# Altium schematic sheet console_schematic_logic.SchDoc
size A4
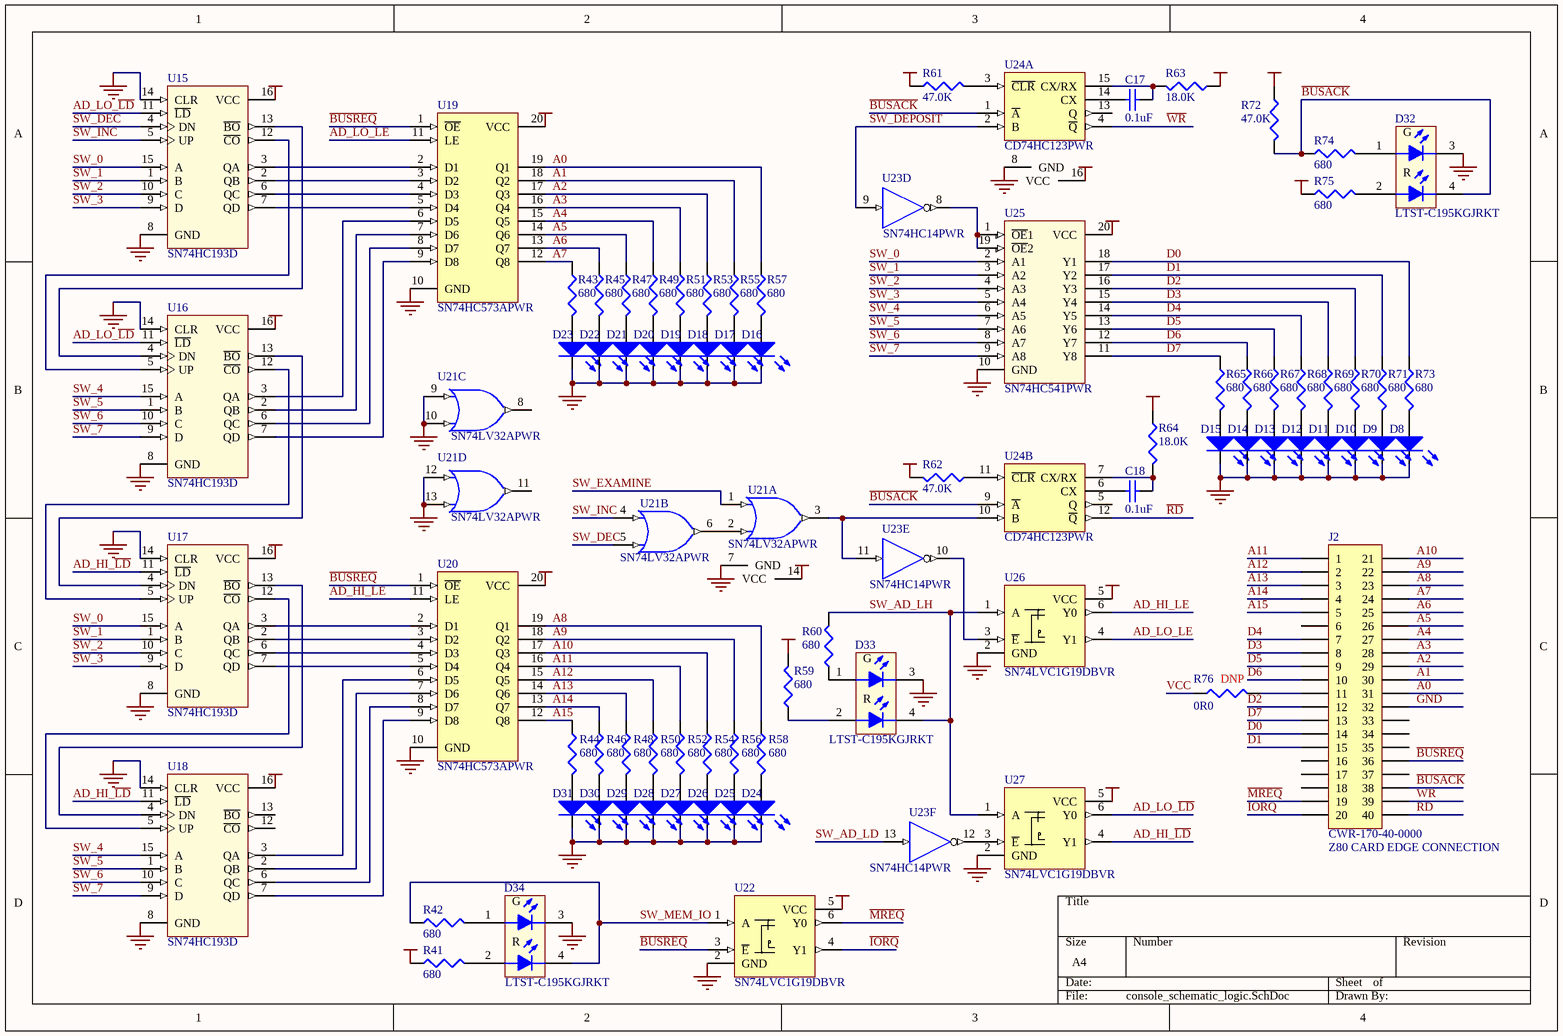
[diagram p0: console_schematic_logic.SchDoc]

## Parts
C17  0.1uF  [0603]
C18  0.1uF  [0603]
D8  LTST-C190KRKT  [APG1608]  (value not drawn)
D9  LTST-C190KRKT  [APG1608]  (value not drawn)
D10  LTST-C190KRKT  [APG1608]  (value not drawn)
D11  LTST-C190KRKT  [APG1608]  (value not drawn)
D12  LTST-C190KRKT  [APG1608]  (value not drawn)
D13  LTST-C190KRKT  [APG1608]  (value not drawn)
D14  LTST-C190KRKT  [APG1608]  (value not drawn)
D15  LTST-C190KRKT  [APG1608]  (value not drawn)
D16  LTST-C190KRKT  [APG1608]  (value not drawn)
D17  LTST-C190KRKT  [APG1608]  (value not drawn)
D18  LTST-C190KRKT  [APG1608]  (value not drawn)
D19  LTST-C190KRKT  [APG1608]  (value not drawn)
D20  LTST-C190KRKT  [APG1608]  (value not drawn)
D21  LTST-C190KRKT  [APG1608]  (value not drawn)
D22  LTST-C190KRKT  [APG1608]  (value not drawn)
D23  LTST-C190KRKT  [APG1608]  (value not drawn)
D24  LTST-C190KRKT  [APG1608]  (value not drawn)
D25  LTST-C190KRKT  [APG1608]  (value not drawn)
D26  LTST-C190KRKT  [APG1608]  (value not drawn)
D27  LTST-C190KRKT  [APG1608]  (value not drawn)
D28  LTST-C190KRKT  [APG1608]  (value not drawn)
D29  LTST-C190KRKT  [APG1608]  (value not drawn)
D30  LTST-C190KRKT  [APG1608]  (value not drawn)
D31  LTST-C190KRKT  [APG1608]  (value not drawn)
D32  LTST-C195KGJRKT  [LTST-C195KGJRKT]
D33  LTST-C195KGJRKT  [LTST-C195KGJRKT]
D34  LTST-C195KGJRKT  [LTST-C195KGJRKT]
J2  CWR-170-40-0000  Notes: Z80 CARD EDGE CONNECTION  [CARD EDGE 40 PIN]
R41  680  [0603]
R42  680  [0603]
R43  680  [0603]
R44  680  [0603]
R45  680  [0603]
R46  680  [0603]
R47  680  [0603]
R48  680  [0603]
R49  680  [0603]
R50  680  [0603]
R51  680  [0603]
R52  680  [0603]
R53  680  [0603]
R54  680  [0603]
R55  680  [0603]
R56  680  [0603]
R57  680  [0603]
R58  680  [0603]
R59  680  [0603]
R60  680  [0603]
R61  47.0K  [0603]
R62  47.0K  [0603]
R63  18.0K  [0603]
R64  18.0K  [0603]
R65  680  [0603]
R66  680  [0603]
R67  680  [0603]
R68  680  [0603]
R69  680  [0603]
R70  680  [0603]
R71  680  [0603]
R72  47.0K  [0603]
R73  680  [0603]
R74  680  [0603]
R75  680  [0603]
R76  0R0  Load: DNP  [0603]
U15  SN74HC193D  [DO16 D R-PDSO-G16]
U16  SN74HC193D  [DO16 D R-PDSO-G16]
U17  SN74HC193D  [DO16 D R-PDSO-G16]
U18  SN74HC193D  [DO16 D R-PDSO-G16]
U19  SN74HC573APWR  [PW020]
U20  SN74HC573APWR  [PW020]
U21  SN74LV32APWR  [PW014]  (parts A,B,C,D of 4)
U22  SN74LVC1G19DBVR  [SOT-23-6 DBV R-PDSO-G6]
U23  SN74HC14PWR  [PW014]  (parts D,E,F of 6)
U24  CD74HC123PWR  [PW016]  (parts A,B of 2)
U25  SN74HC541PWR  [PW020]
U26  SN74LVC1G19DBVR  [SOT-23-6 DBV R-PDSO-G6]
U27  SN74LVC1G19DBVR  [SOT-23-6 DBV R-PDSO-G6]

## Nets
GND: D8.2(K) D9.2(K) D10.2(K) D11.2(K) D12.2(K) D13.2(K) D14.2(K) D15.2(K) D16.2(K) D17.2(K) D18.2(K) D19.2(K) D20.2(K) D21.2(K) D22.2(K) D23.2(K) D24.2(K) D25.2(K) D26.2(K) D27.2(K) D28.2(K) D29.2(K) D30.2(K) D31.2(K) D32.3(K1) D33.3(K1) D34.3(K1) J2.32 U15.8(GND) U15.14(CLR) U16.8(GND) U16.14(CLR) U17.8(GND) U17.14(CLR) U18.8(GND) U18.14(CLR) U19.10(GND) U20.10(GND) U21.7(GND) U21.9(A) U21.10(B) U21.12(A) U21.13(B) U22.2(GND) U23.7(GND) U24.8(GND) U25.10(GND) U26.2(GND) U27.2(GND)
VCC: R41.1 R59.2 R61.1 R62.2 R63.1 R64.1 R72.1 R75.1 R76.1 U15.16(VCC) U16.16(VCC) U17.16(VCC) U18.16(VCC) U19.20(VCC) U20.20(VCC) U21.14(VCC) U22.5(VCC) U23.14(VCC) U24.16(VCC) U25.20(VCC) U26.5(VCC) U27.5(VCC)
A0: J2.31 R57.1 U19.19(Q1)
A1: J2.30 R55.1 U19.18(Q2)
A2: J2.29 R53.1 U19.17(Q3)
A3: J2.28 R51.1 U19.16(Q4)
A4: J2.27 R49.1 U19.15(Q5)
A5: J2.26 R47.1 U19.14(Q6)
A6: J2.25 R45.1 U19.13(Q7)
A7: J2.24 R43.1 U19.12(Q8)
A8: J2.23 R58.1 U20.19(Q1)
A9: J2.22 R56.1 U20.18(Q2)
A10: J2.21 R54.1 U20.17(Q3)
A11: J2.1 R52.1 U20.16(Q4)
A12: J2.2 R50.1 U20.15(Q5)
A13: J2.3 R48.1 U20.14(Q6)
A14: J2.4 R46.1 U20.13(Q7)
A15: J2.5 R44.1 U20.12(Q8)
AD_HI_~{LD}: U17.11(~{LD}) U18.11(~{LD}) U27.4(Y1)
AD_HI_LE: U20.11(LE) U26.6(Y0)
AD_LO_~{LD}: U15.11(~{LD}) U16.11(~{LD}) U27.6(Y0)
AD_LO_LE: U19.11(LE) U26.4(Y1)
~{BUSACK}: D32.4(K2) J2.38 R72.2 R74.1 U24.1(~{A}) U24.9(~{A})
~{BUSREQ}: J2.36 U19.1(~{OE}) U20.1(~{OE}) U22.3(~{E})
D0: J2.14 R73.1 U25.18(Y1)
D1: J2.15 R71.1 U25.17(Y2)
D2: J2.12 R70.1 U25.16(Y3)
D3: J2.8 R69.1 U25.15(Y4)
D4: J2.7 R68.1 U25.14(Y5)
D5: J2.9 R67.1 U25.13(Y6)
D6: J2.10 R66.1 U25.12(Y7)
D7: J2.13 R65.1 U25.11(Y8)
~{IORQ}: J2.20 U22.4(Y1)
~{MREQ}: J2.19 U22.6(Y0)
~{RD}: J2.40 U24.12(~{Q})
SW_0: U15.15(A) U17.15(A) U25.2(A1)
SW_1: U15.1(B) U17.1(B) U25.3(A2)
SW_2: U15.10(C) U17.10(C) U25.4(A3)
SW_3: U15.9(D) U17.9(D) U25.5(A4)
SW_4: U16.15(A) U18.15(A) U25.6(A5)
SW_5: U16.1(B) U18.1(B) U25.7(A6)
SW_6: U16.10(C) U18.10(C) U25.8(A7)
SW_7: U16.9(D) U18.9(D) U25.9(A8)
SW_AD_LD: U23.13(A)
SW_AD_LH: D33.4(K2) R60.2 U26.1(A) U27.1(A)
SW_DEC: U15.4(DN) U21.5(B)
SW_DEPOSIT: U23.9(A) U24.2(B)
SW_EXAMINE: U21.1(A)
SW_INC: U15.5(UP) U21.4(A)
SW_MEM_IO: D34.4(K2) R42.1 U22.1(A)
~{WR}: J2.39 U24.4(~{Q})
NetC17_1: C17.1 U24.14(CX)
NetC17_2: C17.2 R63.2 U24.15(CX/RX)
NetC18_1: C18.1 U24.6(CX)
NetC18_2: C18.2 R64.2 U24.7(CX/RX)
NetD8_1: D8.1(A) R73.2
NetD9_1: D9.1(A) R71.2
NetD10_1: D10.1(A) R70.2
NetD11_1: D11.1(A) R69.2
NetD12_1: D12.1(A) R68.2
NetD13_1: D13.1(A) R67.2
NetD14_1: D14.1(A) R66.2
NetD15_1: D15.1(A) R65.2
NetD16_1: D16.1(A) R57.2
NetD17_1: D17.1(A) R55.2
NetD18_1: D18.1(A) R53.2
NetD19_1: D19.1(A) R51.2
NetD20_1: D20.1(A) R49.2
NetD21_1: D21.1(A) R47.2
NetD22_1: D22.1(A) R45.2
NetD23_1: D23.1(A) R43.2
NetD24_1: D24.1(A) R58.2
NetD25_1: D25.1(A) R56.2
NetD26_1: D26.1(A) R54.2
NetD27_1: D27.1(A) R52.2
NetD28_1: D28.1(A) R50.2
NetD29_1: D29.1(A) R48.2
NetD30_1: D30.1(A) R46.2
NetD31_1: D31.1(A) R44.2
NetD32_1: D32.1(A1) R74.2
NetD32_2: D32.2(A2) R75.2
NetD33_1: D33.1(A1) R60.1
NetD33_2: D33.2(A2) R59.1
NetD34_1: D34.1(A1) R42.2
NetD34_2: D34.2(A2) R41.2
NetJ2_11: J2.11 R76.2
NetR61_2: R61.2 U24.3(~{CLR})
NetR62_1: R62.1 U24.11(~{CLR})
NetU15_2: U15.2(QB) U19.3(D2)
NetU15_3: U15.3(QA) U19.2(D1)
NetU15_6: U15.6(QC) U19.4(D3)
NetU15_7: U15.7(QD) U19.5(D4)
NetU15_12: U15.12(~{CO}) U16.5(UP)
NetU15_13: U15.13(~{BO}) U16.4(DN)
NetU16_2: U16.2(QB) U19.7(D6)
NetU16_3: U16.3(QA) U19.6(D5)
NetU16_6: U16.6(QC) U19.8(D7)
NetU16_7: U16.7(QD) U19.9(D8)
NetU16_12: U16.12(~{CO}) U17.5(UP)
NetU16_13: U16.13(~{BO}) U17.4(DN)
NetU17_2: U17.2(QB) U20.3(D2)
NetU17_3: U17.3(QA) U20.2(D1)
NetU17_6: U17.6(QC) U20.4(D3)
NetU17_7: U17.7(QD) U20.5(D4)
NetU17_12: U17.12(~{CO}) U18.5(UP)
NetU17_13: U17.13(~{BO}) U18.4(DN)
NetU18_2: U18.2(QB) U20.7(D6)
NetU18_3: U18.3(QA) U20.6(D5)
NetU18_6: U18.6(QC) U20.8(D7)
NetU18_7: U18.7(QD) U20.9(D8)
NetU21_2: U21.2(B) U21.6(Y)
NetU21_3: U21.3(Y) U23.11(A) U24.10(B)
NetU23_8: U23.8(~{Y}) U25.1(~{OE}1) U25.19(~{OE}2)
NetU23_10: U23.10(~{Y}) U26.3(~{E})
NetU23_12: U23.12(~{Y}) U27.3(~{E})

Not connected (* = marked no-connect by the designer): J2 6 16 17 18 33 34 35 37; U18 12(~{CO}) 13(~{BO}); U21 8(Y) 11(Y); U24 5(Q) 13(Q)

## Notes on the sheet
- (in symbol LTST-C195KGJRKT) G; R

## Library data of the parts
C17 C18 = C0603: CAP .10UF 16V CERAMIC X7R 0603; Dist: Digi-key; DistPN: 399-1096-1-ND; Load: yes; Mfgr: Kemet; MfgrPN: C0603C104K4RACTU; Polarized: no; Value: 0.1uF; Notes: *; Package: 0603
D8-D31 = LTST-C190KRKT: LED SUPER RED CLEAR 0603 SMD; Dist: Digikey; DistPN: 160-1436-2-ND; Load: yes; Mfgr: Lite-On; MfgrPN: LTST-C190KRKT; Package: 0603; Polarized: yes; Value: LTST-C190KRKT
D32-D34 = LTST-C195KGJRKT: LED GREEN/RED BICOLOR 0606 SMD; Dist: Digi-key; DistPN: 160-1452-1-ND; Mfgr: Lite-On; Polarized: yes; MfgrPN: LTST-C195KGJRKT; Value: LTST-C195KGJRKT; Package: 0606; Load: yes
J2 = CWR-170-40-0000: CONN CARD EDGE 40PIN GOLD; Dist: Digi-Key; DistPN: CCE40G-ND; Load: no; Mfgr: CW Industries; Polarized: YES; MfgrPN: CWR-170-40-0000; Package: *; Value: CWR-170-40-0000
R41-R60 R65-R71 R73-R75 = MCR03EZPFX: RES 680 OHM 1/10W 1% 0603 SMD; Dist: Digi-Key; DistPN: P680HCT-ND; Mfgr: Panasonic; MfgrPN: ERJ-3EKF6800V; Load: yes; Polarized: no; Value: 680; Package: 0603
R61 R62 R72 = MCR03EZPFX: RES 47.0K OHM 1/10W 1% 0603 SMD; Dist: Digi-Key; DistPN: P47.0KHCT-ND; Mfgr: Panasonic; MfgrPN: ERJ-3EKF4702V; Load: yes; Polarized: no; Value: 47.0K; Package: 0603
R63 R64 = MCR03EZPFX: RES 18.0K OHM 1/10W 1% 0603 SMD; Dist: Digi-Key; DistPN: P18.0KHCT-ND; Mfgr: Panasonic; MfgrPN: ERJ-3EKF1802V; Load: yes; Polarized: no; Value: 18.0K; Package: 0603
R76 = ERJ-3EKF1002V: RES 0.0 OHM 1/10W 0603 SMD; Dist: Digikey; DistPN: P0.0GCT-ND; Mfgr: Panasonic; MfgrPN: ERJ-3GEY0R00V; Notes: JUMPER; Polarized: no; Value: 0R0; Package: 0603
U15-U18 = SN74HC193D: IC 4-BIT UP/DOWN COUNTER 16-SOIC; Dist: Digi-key; DistPN: 296-8261-5-ND; Load: yes; Mfgr: Texas Instruments; MfgrPN: SN74HC193D; Package: SOIC-16; Polarized: yes; Value: SN74HC193D
U19 U20 = SN74HC573APWR: IC OCTAL TRANSP LATCH 20-TSSOP; Dist: Digi-key; DistPN: 296-8338-1-ND; Mfgr: Texas Instruments; Polarized: yes; MfgrPN: SN74HC573APWR; Value: SN74HC573APWR; Package: TSSOP-20; Load: yes
U21 = SN74LV32APWR: IC QUAD 2-IN OR GATE 14-TSSOP; Dist: Digi-key; DistPN: 296-3819-1-ND; Mfgr: Texas Instruments; Polarized: yes; MfgrPN: SN74LV32APWR; Load: yes; Package: TSSOP-14; Value: SN74LV32APWR
U22 U26 U27 = SN74LVC1G19DBVR: IC MUX/DECODER SNGL 1OF2 SOT23-6; Dist: Mouser; DistPN: 595-SN74LVC1G19DCKR; Load: yes; Mfgr: Texas Instruments; MfgrPN: SN74LVC1G19DCKR; Package: TSSOP-6; Polarized: yes; Value: SN74LVC1G19DBVR
U23 = SN74HC14PWR: IC HEX SCHMITT-TRIG INV 14-TSSOP; Dist: Avnet; DistPN: SN74HC14PWR/BKN; Load: yes; Mfgr: Texas Instruments; MfgrPN: SN74HC14PWR; Package: TSSOP-14; Polarized: yes; Value: SN74HC14PWR
U24 = CD74HC123PWR: IC DUAL RETRIG MULTIVIB 16-TSSOP; Dist: Digi-key; DistPN: 296-12780-1-ND; Mfgr: Texas Instruments; Polarized: yes; MfgrPN: CD74HC123PWR; Package: TSSOP-16; Value: CD74HC123PWR; Load: yes
U25 = SN74HC541PWR: IC BUFF/DVR TRI-ST 8BIT 20TSSOP; Dist: Digi-Key; DistPN: 296-8335-1-ND; Load: yes; Mfgr: Texas Instruments; MfgrPN: SN74HC541PWR; Package: TSSOP-20; Polarized: yes; Value: SN74HC541PWR